# Altium schematic sheet m12_eth.SchDoc: M12 Ethernet Adapter
size Letter
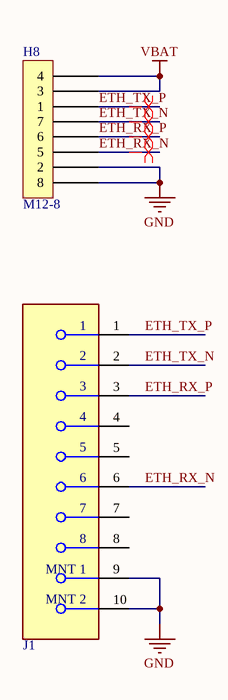
[diagram p0: m12_eth.SchDoc]

## Parts
H8  M12-8  [861-008-113R004]
J1  RJLSE4238101T  [RJ45]  (value not drawn)

## Nets
GND: H8.2 H8.8 J1.9(MNT_1) J1.10(MNT_2)
VBAT: H8.3 H8.4
ETH_RX_N: H8.5 J1.6
ETH_RX_P: H8.6 J1.3
ETH_TX_N: H8.7 J1.2
ETH_TX_P: H8.1 J1.1

Not connected (* = marked no-connect by the designer): J1 4 5 7 8

## Layout directives
differential pair: ETH_RX_N, ETH_RX_P, ETH_TX_N, ETH_TX_P

## Notes on the sheet
- Title
- Size:
- Date:
- Letter
- Number:
- Time:
- Revision:
- Sheet
- of
- File:

## Library data of the parts
H8 = TERM_8P: CONN RCPT MALE 8POS GOLD SOLDER; Manufacturer: NorComp; Connector Type: Receptacle; Number of Positions: 8; Current Rating: 3A; Voltage Rating: 125V; Ratings: IP67,Waterproof,Dust Tight; Supplier 1: Digi-Key; Supplier Part Number 1: NOR1442-ND; Manufacturer Part Number: 861-008-113R004; Category: Circular Connectors; Pricing 1: 1=20.17000, 10=18.20300, 25=17.44000, 50=16.35000, 100=15.80500, 250=14.93300, 500=14.49700, 1000=14.17000 (USD); Mount: Through Hole,Panel; Number of Pins: 8; Contact Plating: Gold; Min Operating Temperature: -40°C; Max Operating Temperature: 85°C; Packaging: Tray; Termination: Solder; Fastening Type: Threaded; REACH SVHC: No SVHC; ComponentLink1URL: http://www.farnell.com/datasheets/2014141.pdf?src-supplier=Farnell; ComponentLink1Description: http://www.farnell.com/datasheets/2014141.pdf?src-supplier=Farnell; ComponentLink2URL: http://www.farnell.com/datasheets/2014141.pdf?src-supplier=Element14; ComponentLink2Description: http://www.farnell.com/datasheets/2014141.pdf?src-supplier=Element14; ComponentLink3URL: https://www.norcomp.net/rohspdfs/Circulars/M12/861-008-113R004.pdf?src-supplier=Digi-Key; ComponentLink3Description: https://www.norcomp.net/rohspdfs/Circulars/M12/861-008-113R004.pdf?src-supplier=Digi-Key
J1 = RJLSE4238101T: CONN MOD JACK 8P8C R/A SHIELDED; Manufacturer: Amphenol Commercial; Number of Ports: 1; Direction: Down; Number of Positions Loaded: 8; Gender: Male; Pitch: 1.27mm; Supplier 1: Digi-Key; Supplier Part Number 1: RJLSE4238101TCT-ND; Manufacturer Part Number: RJLSE4238101T; Category: Modular / Ethernet Connectors; Pricing 1: 1=2.27000, 10=2.06100, 25=1.93520, 50=1.85100 (USD); Mount: Surface Mount; Contact Material: Bronze; Housing Material: Thermoplastic; Contact Plating: Gold; Color: Black; Housing Color: Black; Min Operating Temperature: -55°C; Max Operating Temperature: 85°C; Termination: SMD/SMT; Connector Type: RJ45; Packaging: Tape and Reel; Shielding: Shielded; Number of Rows: 1; Orientation: Right Angle; Package Quantity: 800; Number of Contacts: 8; Length: 15.74mm; Depth: 17.53mm; REACH SVHC: Unknown; Flammability Rating: UL94 V-3; ComponentLink1URL: http://www.mouser.com/ds/2/18/RJHSE%20Series-183739.pdf?src-supplier=Mouser; ComponentLink1Description: http://www.mouser.com/ds/2/18/RJHSE%20Series-183739.pdf?src-supplier=Mouser; ComponentLink2URL: http://components.arrow.com/part/dataview/0323_03288564?src-supplier=Arrow+Europe; ComponentLink2Description: http://components.arrow.com/part/dataview/0323_03288564?src-supplier=Arrow+Europe; ComponentLink3URL: http://www.alliedelec.com/m/d/33c358db59de6280508c67d1721fb3a2.pdf?src-supplier=Allied+Electronics; ComponentLink3Description: http://www.alliedelec.com/m/d/33c358db59de6280508c67d1721fb3a2.pdf?src-supplier=Allied+Electronics